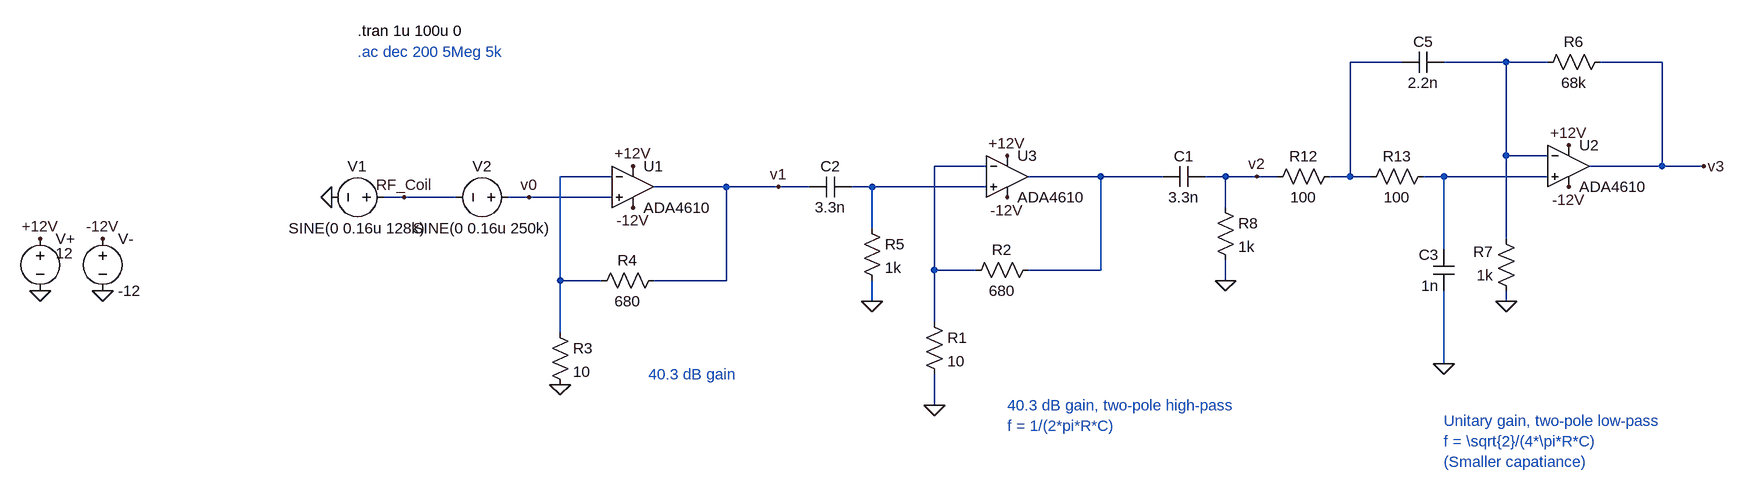
[diagram p0: schematic ReceiveCircuitry.asc]
ReceiveCircuitry.asc, the LTspice schematic file:
Version 4
SHEET 1 2308 2032
WIRE 1632 -32 1552 -32
WIRE 1792 -32 1696 -32
WIRE 1856 -32 1792 -32
WIRE 2032 -32 1936 -32
WIRE 1792 112 1792 -32
WIRE 1856 112 1792 112
WIRE 992 128 912 128
WIRE 2032 128 2032 -32
WIRE 2032 128 1920 128
WIRE 2096 128 2032 128
WIRE 416 144 336 144
WIRE 1168 144 1056 144
WIRE 1264 144 1168 144
WIRE 1360 144 1328 144
WIRE 1408 144 1360 144
WIRE 1440 144 1408 144
WIRE 1552 144 1552 -32
WIRE 1552 144 1520 144
WIRE 1584 144 1552 144
WIRE 1696 144 1664 144
WIRE 1856 144 1696 144
WIRE 592 160 480 160
WIRE 672 160 592 160
WIRE 720 160 672 160
WIRE 816 160 784 160
WIRE 992 160 816 160
WIRE 96 176 64 176
WIRE 176 176 96 176
WIRE 288 176 256 176
WIRE 416 176 288 176
WIRE 1360 192 1360 144
WIRE 816 224 816 160
WIRE 1792 240 1792 112
WIRE 1696 256 1696 144
WIRE 912 288 912 128
WIRE 976 288 912 288
WIRE 1168 288 1168 144
WIRE 1168 288 1056 288
WIRE 336 304 336 144
WIRE 400 304 336 304
WIRE 592 304 592 160
WIRE 592 304 480 304
WIRE 1360 304 1360 272
WIRE 816 336 816 304
WIRE 1792 336 1792 320
WIRE 912 368 912 288
WIRE 336 384 336 304
WIRE 1696 432 1696 320
WIRE 912 496 912 448
FLAG -16 176 0
FLAG -368 320 0
FLAG -464 320 0
FLAG -464 240 +12V
FLAG -368 240 -12V
FLAG 448 192 -12V
FLAG 448 128 +12V
FLAG 336 464 0
FLAG 1024 176 -12V
FLAG 1024 112 +12V
FLAG 912 496 0
FLAG 1888 160 -12V
FLAG 1888 96 +12V
FLAG 1696 432 0
FLAG 816 336 0
FLAG 2096 128 v3
FLAG 96 176 RF_Coil
FLAG 672 160 v1
FLAG 1408 144 v2
FLAG 288 176 v0
FLAG 1792 336 0
FLAG 1360 304 0
SYMBOL voltage 80 176 R90
WINDOW 0 -32 56 VBottom 2
WINDOW 3 32 56 VTop 2
SYMATTR InstName V1
SYMATTR Value SINE(0 0.16u 128k)
SYMATTR Value2 AC 1
SYMBOL voltage -464 224 R0
WINDOW 3 24 38 Left 2
SYMATTR Value 12
SYMATTR InstName V+
SYMBOL voltage -368 224 R0
SYMATTR InstName V-
SYMATTR Value -12
SYMBOL res 320 368 R0
SYMATTR InstName R3
SYMATTR Value 10
SYMBOL res 496 288 R90
WINDOW 0 0 56 VBottom 2
WINDOW 3 32 56 VTop 2
SYMATTR InstName R4
SYMATTR Value 680
SYMBOL Opamps/ADA4610 448 96 R0
SYMATTR InstName U1
SYMBOL res 896 352 R0
SYMATTR InstName R1
SYMATTR Value 10
SYMBOL res 1072 272 R90
WINDOW 0 0 56 VBottom 2
WINDOW 3 32 56 VTop 2
SYMATTR InstName R2
SYMATTR Value 680
SYMBOL Opamps/ADA4610 1024 80 R0
SYMATTR InstName U3
SYMBOL res 1536 128 R90
WINDOW 0 0 56 VBottom 2
WINDOW 3 32 56 VTop 2
SYMATTR InstName R12
SYMATTR Value 100
SYMBOL res 1680 128 R90
WINDOW 0 0 56 VBottom 2
WINDOW 3 32 56 VTop 2
SYMATTR InstName R13
SYMATTR Value 100
SYMBOL Opamps/ADA4610 1888 64 R0
SYMATTR InstName U2
SYMBOL cap 1712 320 R180
WINDOW 0 24 56 Left 2
WINDOW 3 24 8 Left 2
SYMATTR InstName C3
SYMATTR Value 1n
SYMBOL cap 1632 -16 R270
WINDOW 0 32 32 VTop 2
WINDOW 3 0 32 VBottom 2
SYMATTR InstName C5
SYMATTR Value 2.2n
SYMBOL cap 1328 128 R90
WINDOW 0 0 32 VBottom 2
WINDOW 3 32 32 VTop 2
SYMATTR InstName C1
SYMATTR Value 3.3n
SYMBOL cap 784 144 R90
WINDOW 0 0 32 VBottom 2
WINDOW 3 32 32 VTop 2
SYMATTR InstName C2
SYMATTR Value 3.3n
SYMBOL res 800 208 R0
SYMATTR InstName R5
SYMATTR Value 1k
SYMBOL voltage 272 176 R90
WINDOW 0 -32 56 VBottom 2
WINDOW 3 32 56 VTop 2
SYMATTR InstName V2
SYMATTR Value SINE(0 0.16u 250k)
SYMATTR Value2 AC 1
SYMBOL res 1952 -48 R90
WINDOW 0 0 56 VBottom 2
WINDOW 3 32 56 VTop 2
SYMATTR InstName R6
SYMATTR Value 68k
SYMBOL res 1808 336 R180
WINDOW 0 36 76 Left 2
WINDOW 3 36 40 Left 2
SYMATTR InstName R7
SYMATTR Value 1k
SYMBOL res 1344 176 R0
SYMATTR InstName R8
SYMATTR Value 1k
TEXT 24 -80 Left 2 !.tran 1u 100u 0
TEXT 24 -48 Left 2 ;.ac dec 200 5Meg 5k
TEXT 472 448 Left 2 ;40.3 dB gain
TEXT 1024 496 Left 2 ;40.3 dB gain, two-pole high-pass\nf = 1/(2*pi*R*C)
TEXT 1696 520 Left 2 ;Unitary gain, two-pole low-pass\nf = \\sqrt{2}/(4*\\pi*R*C)\n(Smaller capatiance)

The netlist it stands for:
* ReceiveCircuitry.asc
V1 RF_Coil 0 SINE(0 0.16u 128k) AC 1
V+ +12V 0 12
V- -12V 0 -12
R3 N004 0 10
R4 v1 N004 680
XU1 v0 N004 +12V -12V v1 ADA4610  ; pins In+ In- V+ V- OUT
R1 N003 0 10
R2 N005 N003 680
XU3 N007 N003 +12V -12V N005 ADA4610  ; pins In+ In- V+ V- OUT
R12 N001 v2 100
R13 N006 N001 100
XU2 N006 N002 +12V -12V v3 ADA4610  ; pins In+ In- V+ V- OUT
C3 0 N006 1n
C5 N001 N002 2.2n
C1 v2 N005 3.3n
C2 N007 v1 3.3n
R5 N007 0 1k
V2 v0 RF_Coil SINE(0 0.16u 250k) AC 1
R6 v3 N002 68k
R7 0 N002 1k
R8 v2 0 1k
.tran 1u 100u 0
* .ac dec 200 5Meg 5k
* 40.3 dB gain
* 40.3 dB gain, two-pole high-pass
* f = 1/(2*pi*R*C)
* Unitary gain, two-pole low-pass
* f = \sqrt{2}/(4*\pi*R*C)
* (Smaller capatiance)
.backanno
.end